# Altium schematic sheet RGB_Matrix.SchDoc
size A
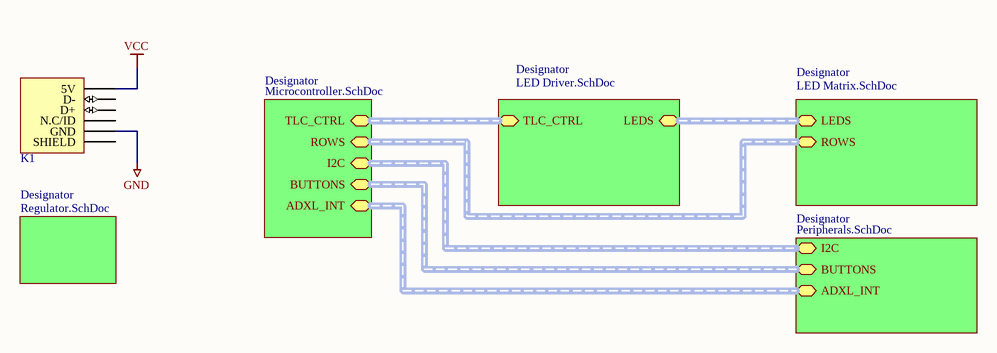
[diagram p0: RGB_Matrix.SchDoc]

## Parts
K1  USB_CONNECTOR_5P  [USB_MINI_SMD]  (value not drawn)

## Sub-sheets
Designator = LED Matrix.SchDoc: LEDS (harness LEDS), ROWS (harness ROWS)
Designator = LED Driver.SchDoc: TLC_CTRL (harness TLC_CTRL), LEDS (harness LEDS)
Designator = Microcontroller.SchDoc: TLC_CTRL (harness TLC_CTRL), ROWS (harness ROWS), I2C (harness I2C), ADXL_INT (harness ADXL_INT), BUTTONS (harness BUTTONS)
Designator = Regulator.SchDoc: no entries
Designator = Peripherals.SchDoc: I2C (harness I2C), ADXL_INT (harness ADXL_INT), BUTTONS (harness BUTTONS)

## Nets
GND: K1.5(GND)
VCC: K1.1(5V)

Not connected (* = marked no-connect by the designer): K1 0(SHIELD) 2(D-) 3(D+) 4(N.C/ID)

## Library data of the parts
K1 = 1753: KONTAKT, SMD; id: 1753; rad: 11; rom: OV; lager_type: Fremlager; dybde: 1; hylle: 6; antall: 200; pakke_opprettet_av: 924; navn: USB mini; pris: 8; nokkelord: USB, USB mini, kontakt, SMD; kolonne: 1; pakke_opprettet: 30-Jul-15 6:08:19 PM; symbol_opprettet_av: 924; symbol_opprettet: 30-Jul-15 6:06:06 PM; pakketype: SMD